# Altium schematic sheet KM+msrts.SchDoc
size A2
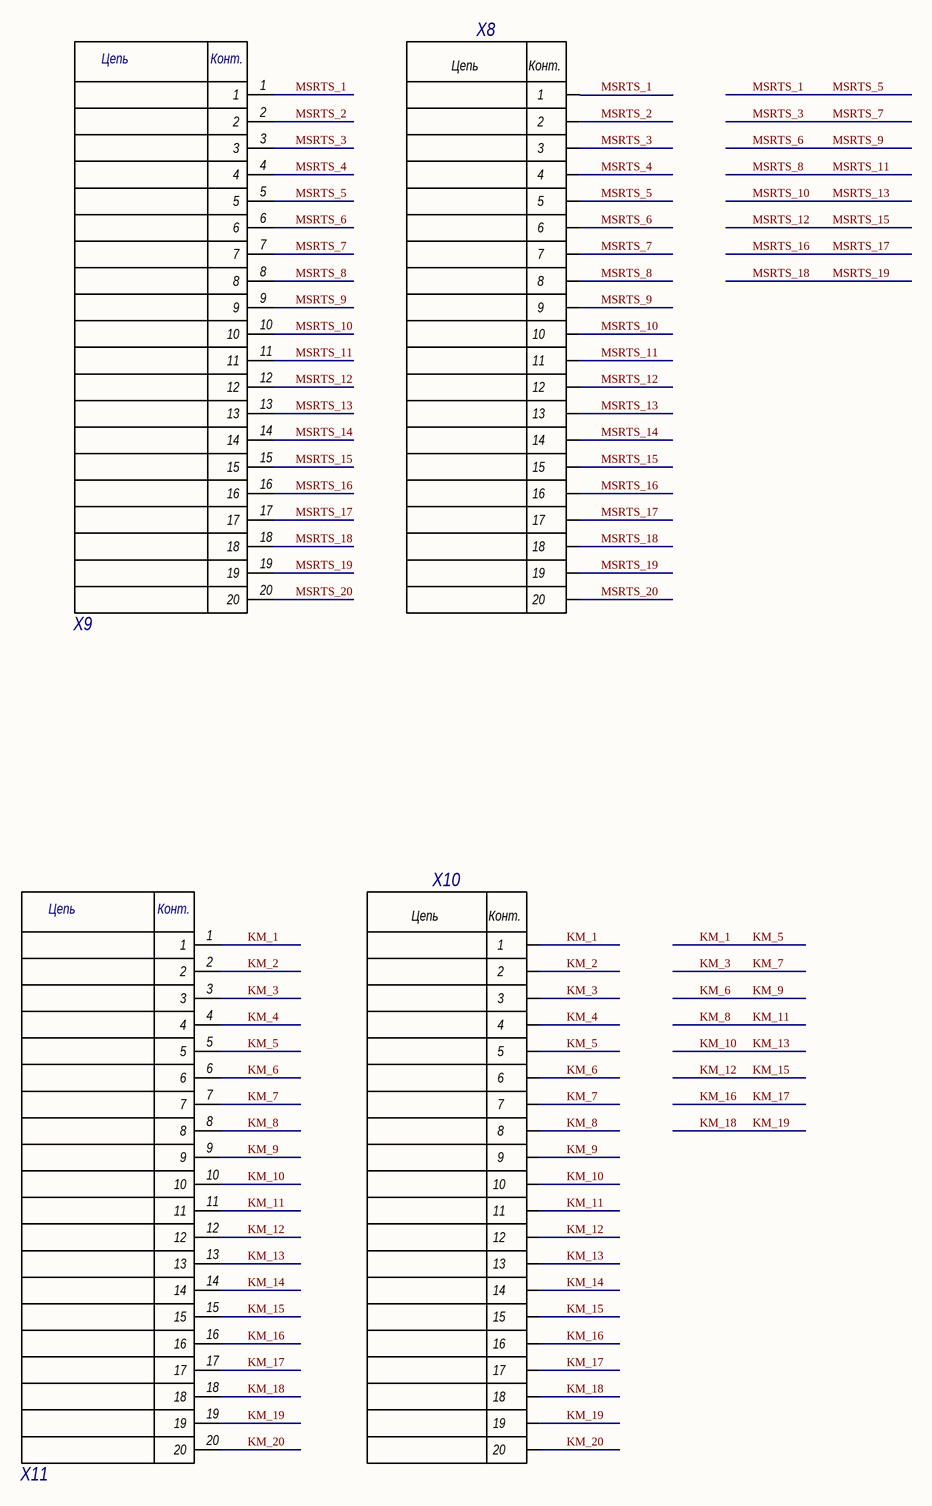
[diagram p0: KM+msrts.SchDoc]

## Parts
X8  PLD-20  [PLD-20]  (value not drawn)
X9  2x10  [5011902017]  (value not drawn)
X10  PLD-20  [PLD-20]  (value not drawn)
X11  2x10  [5011902017]  (value not drawn)

## Nets
KM_1: X10.1 X10.5 X11.1 X11.5  [also labelled KM_5]
KM_2: X10.2 X11.2
KM_3: X10.3 X10.7 X11.3 X11.7  [also labelled KM_7]
KM_4: X10.4 X11.4
KM_6: X10.6 X10.9 X11.6 X11.9  [also labelled KM_9]
KM_10: X10.10 X10.13 X11.10 X11.13  [also labelled KM_13]
KM_11: X10.8 X10.11 X11.8 X11.11  [also labelled KM_8]
KM_12: X10.12 X10.15 X11.12 X11.15  [also labelled KM_15]
KM_14: X10.14 X11.14
KM_16: X10.16 X10.17 X11.16 X11.17  [also labelled KM_17]
KM_18: X10.18 X10.19 X11.18 X11.19  [also labelled KM_19]
KM_20: X10.20 X11.20
MSRTS_1: X8.1 X8.5 X9.1 X9.5  [also labelled MSRTS_5]
MSRTS_2: X8.2 X9.2
MSRTS_3: X8.3 X8.7 X9.3 X9.7  [also labelled MSRTS_7]
MSRTS_4: X8.4 X9.4
MSRTS_6: X8.6 X8.9 X9.6 X9.9  [also labelled MSRTS_9]
MSRTS_10: X8.10 X8.13 X9.10 X9.13  [also labelled MSRTS_13]
MSRTS_11: X8.8 X8.11 X9.8 X9.11  [also labelled MSRTS_8]
MSRTS_12: X8.12 X8.15 X9.12 X9.15  [also labelled MSRTS_15]
MSRTS_14: X8.14 X9.14
MSRTS_16: X8.16 X8.17 X9.16 X9.17  [also labelled MSRTS_17]
MSRTS_18: X8.18 X8.19 X9.18 X9.19  [also labelled MSRTS_19]
MSRTS_20: X8.20 X9.20

## Notes on the sheet
- (in symbol 5011902017) Цепь; Конт.
- (in symbol PLD-20 2.54mm) Цепь; Конт.

## Library data of the parts
X8 X10 = PLD-20 2.54mm: штыри на плату двурядные; PartNumberFrom1C: Штырь PLD-20; Код: 27; 1CType: Штырь; Number of Positions: 20; Pitch - Mating: 2,54 мм; System: Connector; PartNumber: PLD-20 2.54mm; PartNumberFrom1C_accuracy: Штырь PLD-20; OrderCode: PLD-20; Mounting Type: Through Hole; ComponentLink1Description: Технические характеристики
X9 X11 = 5011902017: CONN HEADER SMD 20POS 1MM; PartNumberFrom1C: Вилка Molex 5011902017; Manufacturer: Molex; Код: 181; 1CType: Вилка; Extended Price: $571.24/500; Number of Positions: 20; Number of Positions Loaded: ALL; Pitch - Mating: 0.039" (1.00mm); Row Spacing: 0.105" (2.66mm); System: Connector; PartNumber: 5011902017; PartNumberFrom1C_accuracy: Вилка Molex 5011902017; OrderCode: 5011902017; Unit Price: $1.76; Packaging: Cut Tape (CT); Series: Pico-Clasp 501190; Contact Type: Male Pin; Number of Rows: 2; Mounting Type: Surface Mount; Fastening Type: Latch Holder; Termination: Solder; Contact Finish Thickness: 3.90µin (0.099µm); ComponentLink: https://www.digikey.com/product-detail/en/molex/5011902017/WM7907CT-ND/1531557; ComponentLink1URL: https://www.digikey.com/product-detail/en/molex/5011902017/WM7907CT-ND/1531557; ComponentLink1Description: Технические характеристики